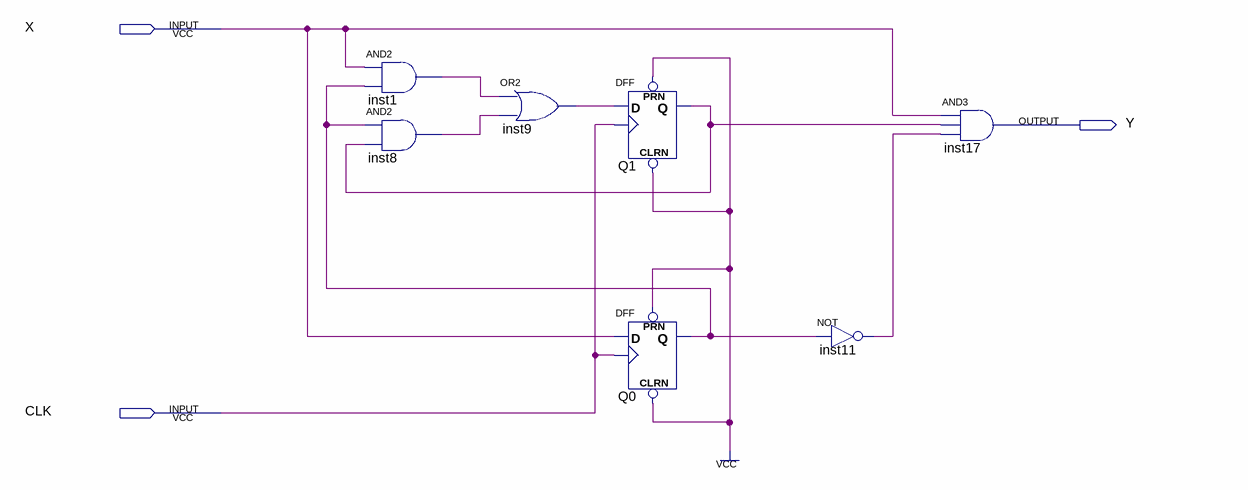
[diagram p0: schematic sheet]
// Quartus schematic SeqDet1101.bdf as structural Verilog: 7 symbols, 3 pins
module SeqDet1101 (
  input  X,
  input  CLK,
  output Y
);

  wire inst1_out, inst8_out, inst9_out, inst11_out, Q0_q, Q1_q;

  and inst1 (inst1_out, X, Q0_q);
  and inst8 (inst8_out, Q0_q, Q1_q);
  or inst9 (inst9_out, inst1_out, inst8_out);
  DFF Q1 (.CLRN(1'b1), .CLK(CLK), .D(inst9_out), .PRN(1'b1), .Q(Q1_q));
  DFF Q0 (.CLRN(1'b1), .CLK(CLK), .D(X), .PRN(1'b1), .Q(Q0_q));
  not inst11 (inst11_out, Q0_q);
  and inst17 (Y, X, Q1_q, inst11_out);
endmodule
